# Altium schematic sheet USB-TTL.SchDoc
size A4
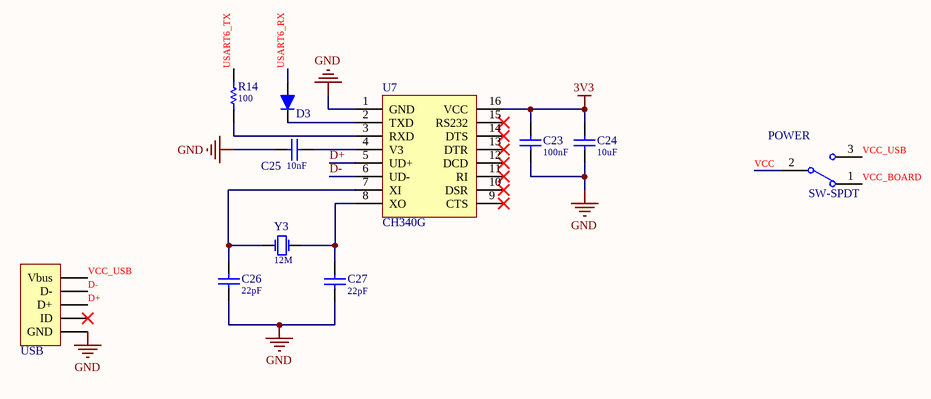
[diagram p0: USB-TTL.SchDoc]

## Parts
C23  value 100nF  [C0603-L]  (hidden comment: Cap-S)
C24  value 10uF  [C0603-L]  (hidden comment: Cap-S)
C25  value 10nF  [C0603-L]  (hidden comment: Cap-S)
C26  value 22pF  [C0603-L]  (hidden comment: Cap-S)
C27  value 22pF  [C0603-L]  (hidden comment: Cap-S)
D3  D  [D-SMA]  (value not drawn)
POWER  SW-SPDT  [SW-SPDT]
R14  value 100  [R0603-L]  (hidden comment: R)
U7  CH340G  [SOP-16]
USB  USB_Mini/Micro  [USB_Micro]  (value not drawn)
Y3  value 12M  [XTAL-PB2-DIP]  (hidden comment: XTAL)

## Nets
3V3: C23.2 C24.2 U7.16(VCC)
GND: C23.1 C24.1 C25.1 C26.1 C27.1 U7.1(GND) USB.5(GND)
D+: U7.5(UD+) USB.3(D+)
D-: U7.6(UD-) USB.2(D-)
USART6_RX: D3.1
USART6_TX: R14.2
VCC: POWER.2
VCC_BOARD: POWER.1
VCC_USB: POWER.3 USB.1(Vbus)
NetC25_2: C25.2 U7.4(V3)
NetC26_2: C26.2 U7.7(XI) Y3.1(OSC1)
NetC27_2: C27.2 U7.8(XO) Y3.2(OSC2)
NetD3_2: D3.2 U7.2(TXD)
NetR14_1: R14.1 U7.3(RXD)

Not connected (* = marked no-connect by the designer): U7 9(CTS)* 10(DSR)* 11(RI)* 12(DCD)* 13(DTR)* 14(DTS)* 15(RS232)*; USB 4(ID)*

## Library data of the parts
C23-C27 = Cap-S: 贴片瓷片电容
D3 = Diode: 二极管
POWER = SW-SPDT: SPDT Subminiature Toggle Switch, Right Angle Mounting, Vertical Actuation; ComponentLink1Description: Manufacturer Link; ComponentLink1URL: http://www.apem.com
R14 = Res: 贴片电阻
U7 = CH340G: SOP16
USB = USB: Mini/Micro USB母口
Y3 = XTAL: 晶振